# EAGLE schematic C6 (EAGLE 7.5.0)

## Sheet 1 of 2: Schematic
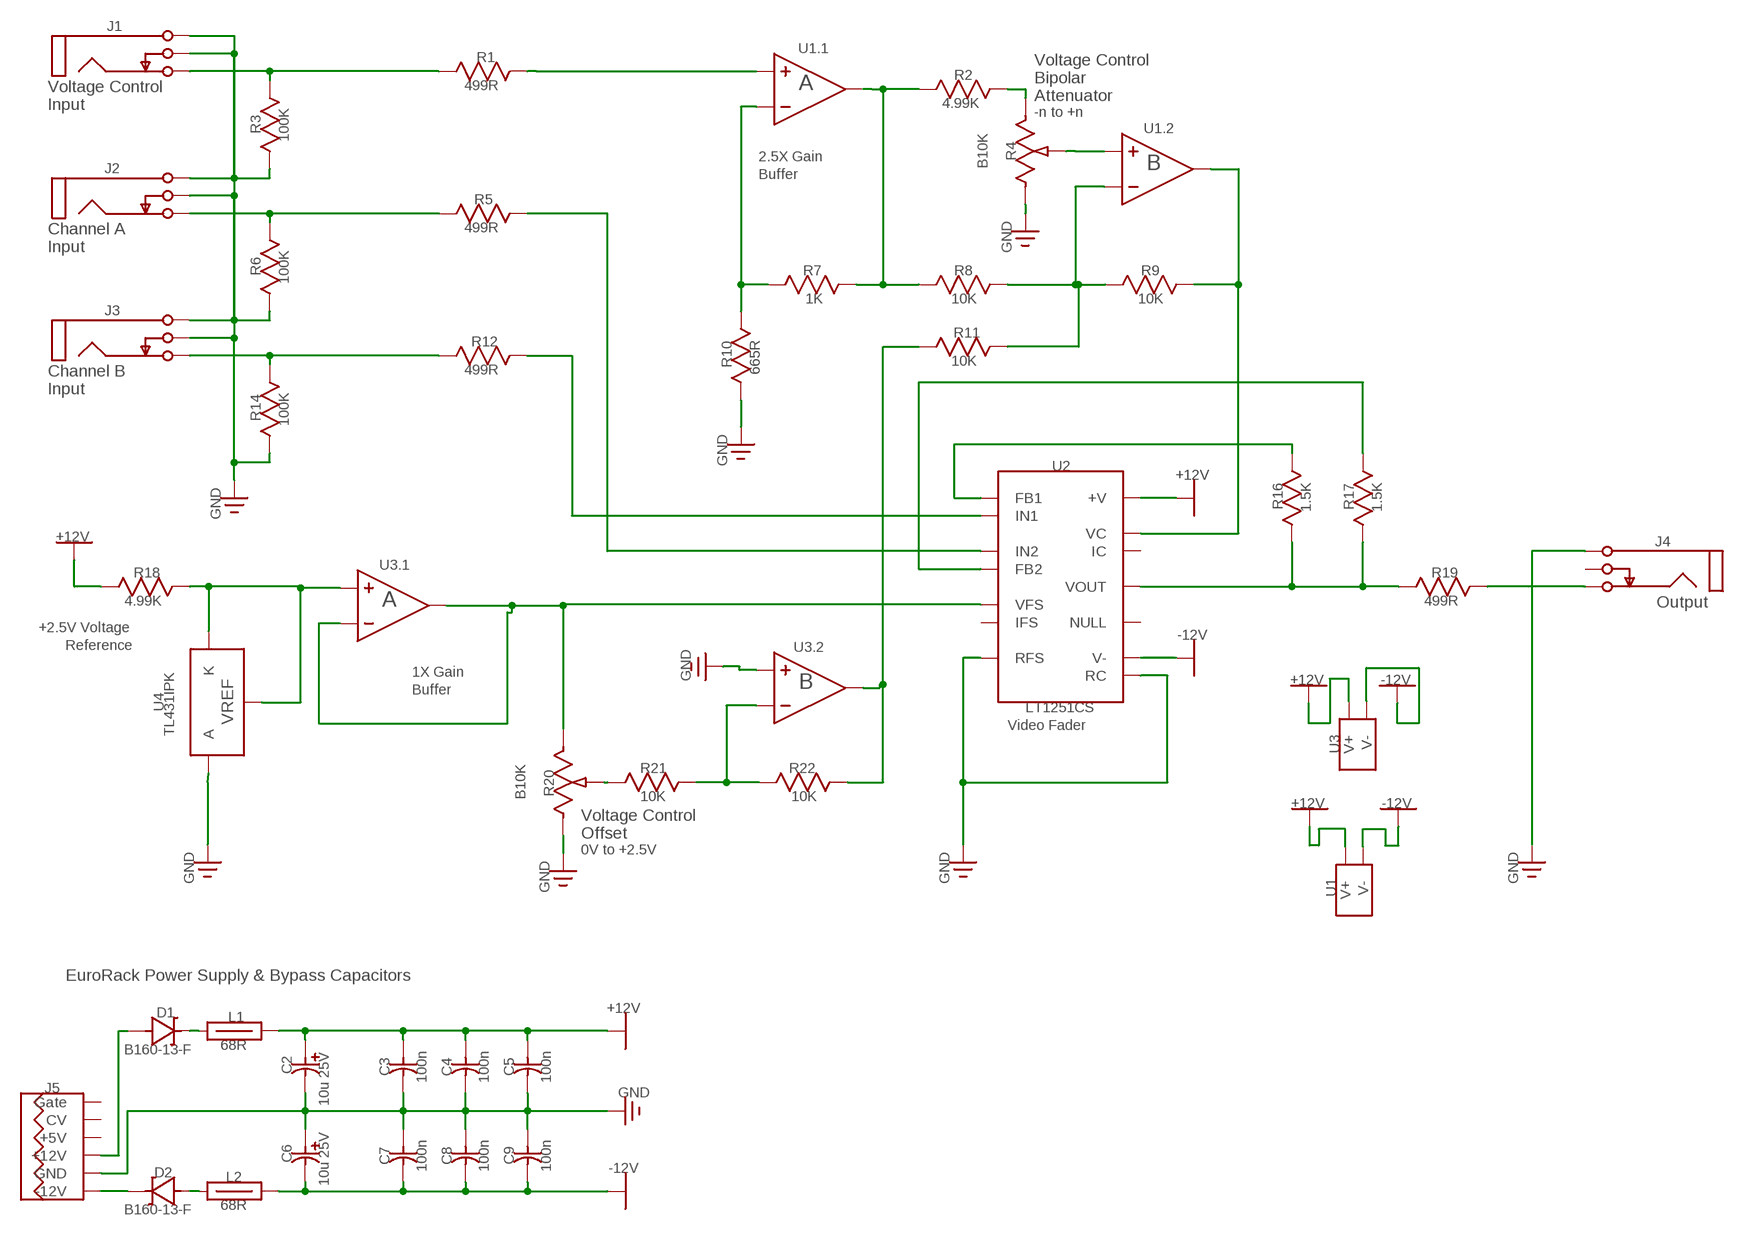
[diagram p0: schematic, sheet 1]

### Parts
C2  10u 25V  EC80-5  [CAPPR-2/5.08]
C3  100n  CAP_0603  [CAP_0603]
C4  100n  CAP_0603  [CAP_0603]
C5  100n  CAP_0603  [CAP_0603]
C6  10u 25V  EC80-5  [CAPPR-2/5.08]
C7  100n  CAP_0603  [CAP_0603]
C8  100n  CAP_0603  [CAP_0603]
C9  100n  CAP_0603  [CAP_0603]
D1  B160-13-F  [SMA]
D2  B160-13-F  [SMA]
J1  PJ302M  [PJ302M]
J2  PJ302M  [PJ302M]
J3  PJ302M  [PJ302M]
J4  PJ302M_2  [PJ302M]
J5  EUROPWR16  [IDC16M]
L1  68R  FB_0805  [RES_0805]
L2  68R  FB_0805  [RES_0805]
R1  499R  RES_0603  [RES_0603]
R2  4.99K  RES_0603  [RES_0603]
R3  100K  RES_0603  [RES_0603]
R4  B10K  ALPHA9H  [ALPHA9H]
R5  499R  RES_0603  [RES_0603]
R6  100K  RES_0603  [RES_0603]
R7  1K  RES_0603  [RES_0603]
R8  10K  RES_0603  [RES_0603]
R9  10K  RES_0603  [RES_0603]
R10  665R  RES_0603  [RES_0603]
R11  10K  RES_0603  [RES_0603]
R12  499R  RES_0603  [RES_0603]
R14  100K  RES_0603  [RES_0603]
R16  1.5K  RES_0603  [RES_0603]
R17  1.5K  RES_0603  [RES_0603]
R18  4.99K  RES_0603  [RES_0603]
R19  499R  RES_0603  [RES_0603]
R20  B10K  ALPHA9H  [ALPHA9H]
R21  10K  RES_0603  [RES_0603]
R22  10K  RES_0603  [RES_0603]
U1  LM6172IM/NOPB  [SOIC-8/150MIL]
U2  LT1251CS  [SOIC-14/150MIL]
U3  TL072D  [SOIC-8/150MIL]
U4  TL431IPK  [SOT23]

### Nets
0V: C2.2(MINUS) C3.2 C4.2 C5.2 C6.1(PLUS) C7.1 C8.1 C9.1 J1.1A(Sleeve) J1.1B(Sleeve) J1.2A(Switch) J1.2B(Switch) J2.1A(Sleeve) J2.1B(Sleeve) J2.2A(Switch) J2.2B(Switch) J3.1A(Sleeve) J3.1B(Sleeve) J3.2A(Switch) J3.2B(Switch) J4.1A(Sleeve) J4.1B(Sleeve) J5.3(GND) J5.4(GND) J5.5(GND) R3.1 R4.1(CCW) R6.1 R10.1 R14.1 R20.1(CCW) U2.5(RC) U2.10(RFS) U3.5(PART_2:IN+) U4.3(A) ; supply symbol labelled GND
+2.5V_Reference: R20.3(CW) U2.12(VFS) U3.1(PART_1:OUT) U3.2(PART_1:IN-)
+12V: C2.1(PLUS) C3.1 C4.1 C5.1 L1.2 R18.2 U1.8(VCC_AND_GND:V+) U2.9(+V) U3.8(VCC_AND_GND:V+)
-12V: C6.2(MINUS) C7.2 C8.2 C9.2 L2.2 U1.4(VCC_AND_GND:V-) U2.7(V-) U3.4(VCC_AND_GND:V-)
BIAS_CTRL_BUFFERED: R11.1 R22.2 U3.7(PART_2:OUT)
BUFFERED_VC_TO_FADER: R9.2 U1.7(PART_2:OUT) U2.3(VC)
Net_1: D2.2(A) L2.1
Net_2: D1.1(K) L1.1
Net_5: D2.1(K) J5.1(-12V) J5.2(-12V)
Net_9: R1.2 U1.3(PART_1:IN+)
Net_11: R4.2(W) U1.5(PART_2:IN+)
Net_17: R2.2 R4.3(CW)
Net_28: R20.2(W) R21.1
Net_31: R5.2 U2.14(IN2)
Net_32: R12.2 U2.1(IN1)
Net_33: D1.2(A) J5.9(+12V) J5.10(+12V)
Net_34: J4.3A(Tip) J4.3B(Tip) R19.2
Net_45: R16.1 R17.2 R19.1 U2.8(VOUT)
Net_46: R17.1 U2.13(FB2)
Net_49: R16.2 U2.2(FB1)
Net_50: R18.1 U3.3(PART_1:IN+) U4.1(K) U4.2(VREF)
Net_52: R7.1 R10.2 U1.2(PART_1:IN-)
Net_53: R2.1 R7.2 R8.1 U1.1(PART_1:OUT)
Net_54: R8.2 R9.1 R11.2 U1.6(PART_2:IN-)
Net_58: J1.3A(Tip) J1.3B(Tip) R1.1 R3.2
Net_60: R21.2 R22.1 U3.6(PART_2:IN-)
Net_63: J2.3A(Tip) J2.3B(Tip) R5.1 R6.2
Net_64: J3.3A(Tip) J3.3B(Tip) R12.1 R14.2
Unconnected: J4.2A(Switch) J4.2B(Switch) J5.11(+5V) J5.12(+5V) J5.13(CV) J5.14(CV) J5.15(Gate) J5.16(Gate) U2.4(IC) U2.6(NULL) U2.11(IFS)

### Notes on the sheet
- J1
- U1.1 | Voltage Control
- R1
- A | Bipolar
- Voltage Control | 499R | R2
- Attenuator
- Input | 4.99K
- -n to +n
- R3 | U1.2
- 100K
- 2.5X Gain | B
- R4
- Buffer | B10K
- J2
- R5
- Channel A | 499R
- Input
- GND
- R6 | R7 | R8 | R9
- 100K
- 1K | 10K | 10K
- J3
- R11
- R12
- 10K
- Channel B | 499R | R10
- 665R
- Input
- R14
- 100K
- GND
- U2
- +12V
- R16 | 1.5K | R17 | 1.5K
- GND
- +12V
- J4
- U3.1
- R18 | R19
- A
- 4.99K | 499R | Output
- +2.5V Voltage
- Reference | -12V
- U3.2
- 1X Gain
- B
- Buffer | GND | +12V | -12V
- LT1251CS
- U4
- Video Fader
- VREF
- TL431IPK
- U3
- R21 | R22
- 10K | 10K
- B10K | R20
- Voltage Control | +12V | -12V
- Offset
- 0V to +2.5V
- GND | GND | GND
- GND | U1
- EuroRack Power Supply & Bypass Capacitors
- +12V
- D1
- L1
- 68R
- B160-13-F
- C2 | C3 | C4 | C5
- 100n | 100n | 100n
- J5
- GND
- 10u 25V
- C6 | C7 | C8 | C9
- 100n | 100n | 100n | -12V
- D2
- L2 | 10u 25V
- 68R
- B160-13-F

## Sheet 2 of 2: BOM
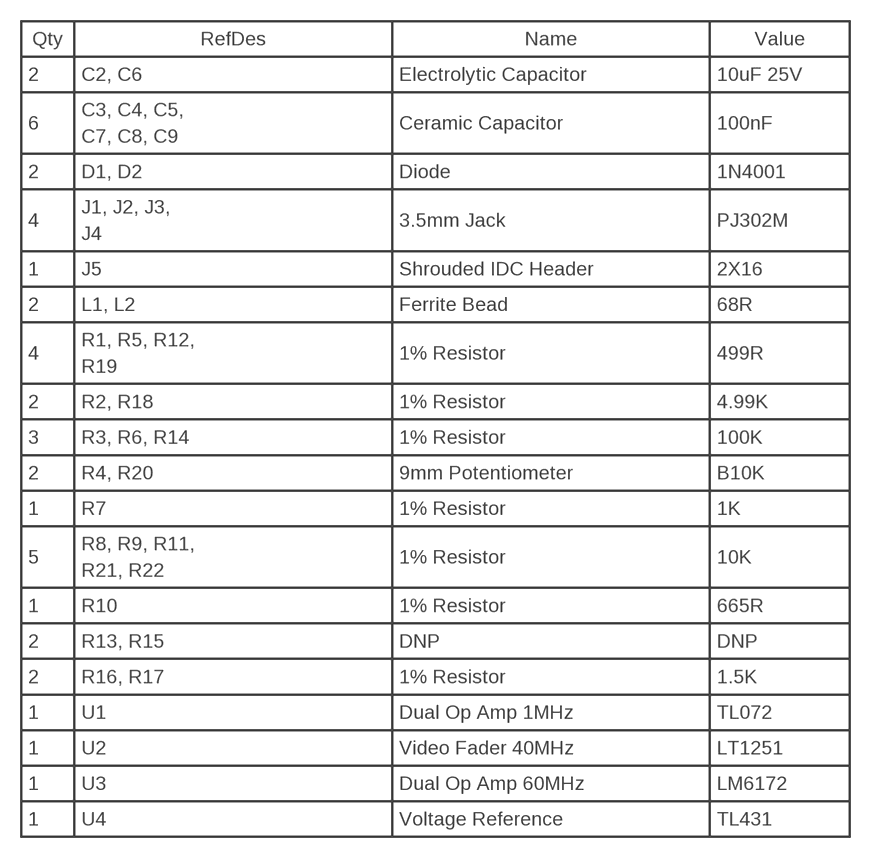
[diagram p1: schematic, sheet 2]

### Notes on the sheet
- Qty | RefDes | Name | Value
- 2 | C2, C6 | Electrolytic Capacitor | 10uF 25V
- 6
- C3, C4, C5,
  C7, C8, C9
- Ceramic Capacitor | 100nF
- 2 | D1, D2 | Diode | 1N4001
- 4
- J1, J2, J3,
  J4
- 3.5mm Jack | PJ302M
- 1 | J5 | Shrouded IDC Header | 2X16
- 2 | L1, L2 | Ferrite Bead | 68R
- 4
- R1, R5, R12,
  R19
- 1% Resistor | 499R
- 2 | R2, R18 | 1% Resistor | 4.99K
- 3 | R3, R6, R14 | 1% Resistor | 100K
- 2 | R4, R20 | 9mm Potentiometer | B10K
- 1 | R7 | 1% Resistor | 1K
- 5
- R8, R9, R11,
  R21, R22
- 1% Resistor | 10K
- 1 | R10 | 1% Resistor | 665R
- 2 | R13, R15 | DNP | DNP
- 2 | R16, R17 | 1% Resistor | 1.5K
- 1 | U1 | Dual Op Amp 1MHz | TL072
- 1 | U2 | Video Fader 40MHz | LT1251
- 1 | U3 | Dual Op Amp 60MHz | LM6172
- 1 | U4 | Voltage Reference | TL431

## Library data of the parts
C2 C6 = common:EC80-5
C3-C5 C7-C9 = common:CAP_0603
D1 D2 = common:B160-13-F
J1-J3 = common:PJ302M; DATASHEET: http://www.thonk.co.uk/shop/pj302m/
J4 = common:PJ302M_2; DATASHEET: http://www.thonk.co.uk/shop/pj302m/
J5 = common:EUROPWR16
L1 L2 = common:FB_0805
R1 R5 R12 R19 = common:RES_0603
R2 R3 R6-R11 R14 R16-R18 R21 R22 = common:RES_0603; VALUE: 499R
R4 R20 = common:ALPHA9H; DATASHEET: http://www.thonk.co.uk/shop/alpha-9mm-pots/; MANUFACTURER: Alpha
U1 = common:LM6172IM/NOPB; DATASHEET: http://www.ti.com/lit/gpn/lm6172; MANUFACTURER: Texas Instruments
U2 = common:LT1251CS; DATASHEET: http://datasheets.diptrace.com\linear\LT1251_1256.pdf; MANUFACTURER: Linear
U3 = common:TL072D; DATASHEET: http://www.ti.com/lit/gpn/lm6172; MANUFACTURER: Texas Instruments
U4 = common:TL431IPK; DATASHEET: http://datasheets.diptrace.com\ti\TL431.pdf; MANUFACTURER: Texas Instruments